# Altium schematic sheet [03] - LoRa MODULE AND CONNECTIONS.SchDoc
size A4; DocumentNumber: 3; SheetNumber: 3; SheetTotal: 6
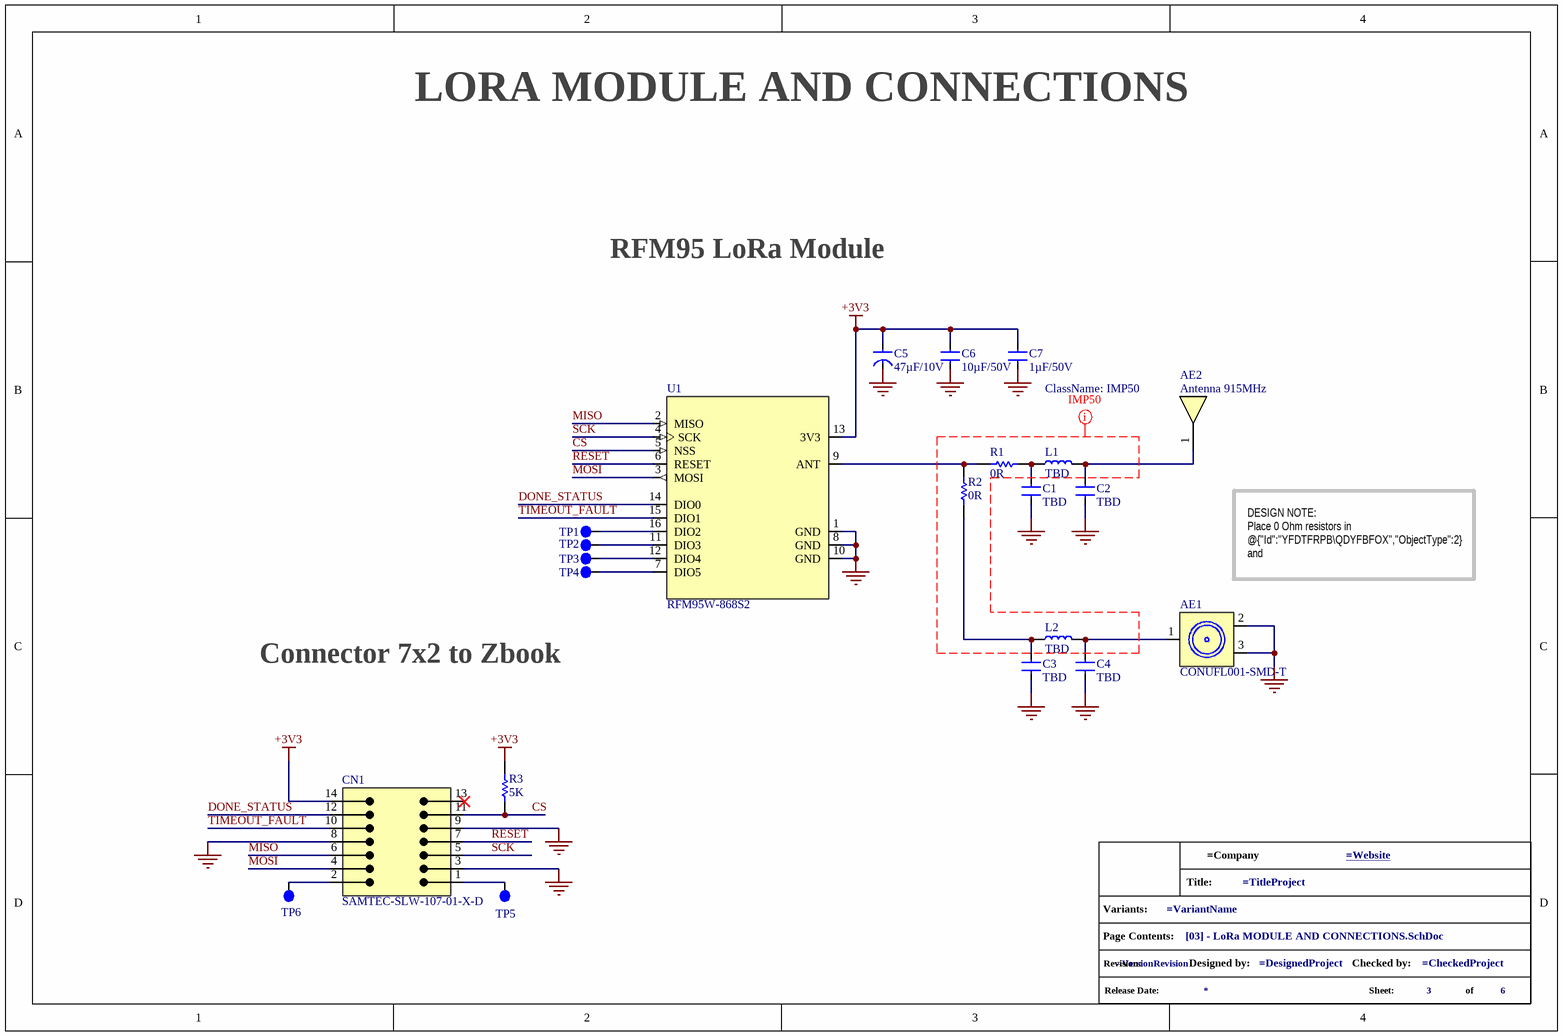
[diagram p0: [03] - LoRa MODULE AND CONNECTIONS.SchDoc]

## Parts
*?  info_project  (value not drawn)  (graphical)
AE1  CONUFL001-SMD-T  [LINX_CONUFL001-SMD-T]
AE2  Antenna 915MHz  [0915AT43A0026]
C1  TBD  [C0603]
C2  TBD  [C0603]
C3  TBD  [C0603]
C4  TBD  [C0603]
C5  47µF/10V  [WCAP-PSLP_5X5.5(DXL)]
C6  10µF/50V  [C0805]
C7  1µF/50V  [C0402]
CN1  SAMTEC-SLW-107-01-X-D  [SAMTEC-SLW-107-01-X-D]
L1  TBD  [L0603]
L2  TBD  [L0603]
R1  0R  [R0603]
R2  0R  [R0603]
R3  5K  [R0402]
TP1  TestPoint  [Test Point]  (value not drawn)  (no BOM)
TP2  TestPoint  [Test Point]  (value not drawn)  (no BOM)
TP3  TestPoint  [Test Point]  (value not drawn)  (no BOM)
TP4  TestPoint  [Test Point]  (value not drawn)  (no BOM)
TP5  TestPoint  [Test Point]  (value not drawn)  (no BOM)
TP6  TestPoint  [Test Point]  (value not drawn)  (no BOM)
U1  RFM95W-868S2  [XCVR_RFM95W-868S2]

## Nets
+3V3: C5.1 C6.2 C7.2 CN1.14 R3.2 U1.13(3V3)
GND: AE1.2 AE1.3 C1.1 C2.1 C3.1 C4.1 C5.2 C6.1 C7.1 CN1.3 CN1.8 CN1.9 U1.1(GND) U1.8(GND) U1.10(GND)
CS: CN1.11 R3.1 U1.5(NSS)
DONE_STATUS: CN1.12 U1.14(DIO0)
MISO: CN1.6 U1.2(MISO)
MOSI: CN1.4 U1.3(MOSI)
RESET: CN1.7 U1.6(RESET)
SCK: CN1.5 U1.4(SCK)
TIMEOUT_FAULT: CN1.10 U1.15(DIO1)
NetAE1_1: AE1.1 C4.2 L2.2
NetAE2_1: AE2.1(Feeding_Point) C2.2 L1.2
NetC1_2: C1.2 L1.1 R1.2
NetC3_2: C3.2 L2.1 R2.1
NetCN1_1: CN1.1 TP5.1
NetCN1_2: CN1.2 TP6.1
NetR1_1: R1.1 R2.2 U1.9(ANT)
NetTP1_1: TP1.1 U1.16(DIO2)
NetTP2_1: TP2.1 U1.11(DIO3)
NetTP3_1: TP3.1 U1.12(DIO4)
NetTP4_1: TP4.1 U1.7(DIO5)

Not connected (* = marked no-connect by the designer): CN1 13*

## Layout directives
net class IMP50: GND

## Notes on the sheet
- LORA MODULE AND CONNECTIONS
- RFM95 LoRa Module
- DESIGN NOTE:
  Place 0 Ohm resistors in @{"Id":"YFDTFRPB\QDYFBFOX","ObjectType":2} and @{"Id":"YFDTFRPB\AJFOYPLD","ObjectType":2} to use the antennas without optimization.
- Connector 7x2 to Zbook
- (in symbol info_project) Title:; Variants:; Page Contents:; Revision:; Designed by:; Checked by:; Release Date:; Sheet:; of

## Library data of the parts
*? = info_project: GRAPHICAL - Info Project
AE1 = CONUFL001-SMD-T: RF CONN - U.FL/MHF1 Jack 50 Ohm PCB Surface Mount; Manufacturer 1: TE Connectivity; .Mounting: SMD; SnapEDA_Link: https://www.snapeda.com/parts/CONUFL001-SMD-T/TE+Connectivity/view-part/?ref=snap; Package: None; Value: *; Manufacturer Part Number 1: CONUFL001-SMD-T; Check_prices: https://www.snapeda.com/parts/CONUFL001-SMD-T/TE+Connectivity/view-part/?ref=eda; .PCBChecked: *; .SCHChecked: *
AE2 = 0915AT43A0026E: RF ANT - 915MHZ  CHIP SOLDER SMD; Manufacturer: Johanson Manufactoring; Resistance: 50R; .SCHChecked: Alex Batista; Supplier 1: Digi-Key; Manufacturer Part Number: 0915AT43A0026E; Stock 1: 21212; Pricing 1: 1=0.84000, 10=0.75200, 25=0.71400, 100=0.58650, 250=0.54824, 500=0.48450 (USD); RoHS: Yes; ComponentLink1URL: http://www.johansontechnology.com/images/stories/ip/rf-antennas/Antenna_0915AT43A0026_v2.pdf?src-supplier=Farnell; ComponentLink1Description: http://www.johansontechnology.com/images/stories/ip/rf-antennas/Antenna_0915AT43A0026_v2.pdf?src-supplier=Farnell; ComponentLink2URL: http://www.farnell.com/datasheets/1928701.pdf?src-supplier=Newark; ComponentLink2Description: http://www.farnell.com/datasheets/1928701.pdf?src-supplier=Newark; ComponentLink3URL: http://www.farnell.com/datasheets/1318299.pdf?src-supplier=Newark; ComponentLink3Description: http://www.farnell.com/datasheets/1318299.pdf?src-supplier=Newark; Supplier Part Number 1: 712-1535-1-ND; .PCBChecked: Alex Batista
C1-C4 = MLCC_0603: MLCC - TBD 0603
C5 = WCAP-PSLP_5X5.5: CAP - 47UF 20% 10V; Manufacturer 1: Würth Elektronik; Manufacturer Part Number 1: 875105242006; .Mounting: SMD; Package: None; Price: None; Value: *; Availability: Unavailable; .PCBChecked: *; .SCHChecked: *
C6 = GRM21BR61H106KE43L: MLCC - 10µF 50V X5R 0805 ±10%; Manufacturer 1: Murata; Manufacturer Lifecycle Status: IN PRODUCTION; Dielectric Material: Ceramic; .Mounting: SMT; Supplier: Avnet; Supplier Part Number: GRM21BR61H106KE43L; Manufacturer Part Number 1: GRM21BR61H106KE43L; RoHS: Compliant; Category: Ceramic Capacitors; Stock: 525000; Pricing: 3000=0,05122, 6000=0,0502, 12000=0,04948, 24000=0,04878, 48000=0,04738 (USD); Value: 10µF; Case/Package: 0805; Country of Origin: Japan, Mainland China, Philippines, Singapore, Thailand; Dielectric: X5R; Export Control Classification Number (ECCN) Code: EAR99; Height: 1.25mm; Harmonized Tariff Schedule (HTS) Code: 8532.24.00.20; Introduction Date: 2018-09-13; Length: 2mm; Lifecycle Status: Production; Material: Ceramic; Max Operating Temperature: 85°C; Min Operating Temperature: -55°C; Mounting Technology: Surface Mount; Number of Terminals: 2; REACH SVHC: Yes; Thickness: 1.25mm; Tolerance: 10%; Voltage Rating: 50V; Voltage Rating (DC): 50V; Width: 1.25mm; ComponentLink1URL: https://datasheet.octopart.com:443/GRM21BR61H106KE43L-Murata-datasheet-155345082.pdf?src-supplier=Newark; ComponentLink1Description: https://datasheet.octopart.com:443/GRM21BR61H106KE43L-Murata-datasheet-155345082.pdf?src-supplier=Newark; ComponentLink2URL: https://datasheet.octopart.com:443/GRM21BR61H106KE43L-Murata-datasheet-141278272.pdf?src-supplier=Geoflip; ComponentLink2Description: https://datasheet.octopart.com:443/GRM21BR61H106KE43L-Murata-datasheet-141278272.pdf?src-supplier=Geoflip; ComponentLink3URL: https://datasheet.octopart.com:443/GRM21BR61H106KE43L-Murata-datasheet-165579666.pdf?src-supplier=TME; ComponentLink3Description: https://datasheet.octopart.com:443/GRM21BR61H106KE43L-Murata-datasheet-165579666.pdf?src-supplier=TME; ComponentLink4URL: https://datasheet.octopart.com:443/GRM21BR61H106KE43L-Murata-datasheet-140707579.pdf?src-supplier=Ciiva; ComponentLink4Description: https://datasheet.octopart.com:443/GRM21BR61H106KE43L-Murata-datasheet-140707579.pdf?src-supplier=Ciiva; ComponentLink5URL: https://datasheet.octopart.com:443/GRM21BR61H106KE43L-Murata-datasheet-138744880.pdf?src-supplier=Ciiva; ComponentLink5Description: https://datasheet.octopart.com:443/GRM21BR61H106KE43L-Murata-datasheet-138744880.pdf?src-supplier=Ciiva; ComponentLink6URL: https://datasheet.octopart.com/GRM21BR61H106KE43L-Murata-datasheet-12515295.pdf; ComponentLink6Description: https://datasheet.octopart.com/GRM21BR61H106KE43L-Murata-datasheet-12515295.pdf; ComponentLink7URL: https://datasheet.octopart.com/GRM21BR61H106KE43L-Murata-datasheet-12510076.pdf; ComponentLink7Description: https://datasheet.octopart.com/GRM21BR61H106KE43L-Murata-datasheet-12510076.pdf; ComponentLink8URL: https://datasheet.octopart.com/GRM21BR61H106KE43L-Murata-datasheet-11978611.pdf; ComponentLink8Description: https://datasheet.octopart.com/GRM21BR61H106KE43L-Murata-datasheet-11978611.pdf; ComponentLink9URL: https://datasheet.octopart.com/GRM21BR61H106KE43L-Murata-datasheet-10025737.pdf; ComponentLink9Description: https://datasheet.octopart.com/GRM21BR61H106KE43L-Murata-datasheet-10025737.pdf; ComponentLink10URL: https://datasheet.octopart.com/GRM21BR61H106KE43L-Murata-datasheet-8819587.pdf; ComponentLink10Description: https://datasheet.octopart.com/GRM21BR61H106KE43L-Murata-datasheet-8819587.pdf; ComponentLink11URL: http://sigma.octopart.com:80/reach_statement/Murata-company-16.pdf?src-supplier=Compliance+Statements; ComponentLink11Description: http://sigma.octopart.com:80/reach_statement/Murata-company-16.pdf?src-supplier=Compliance+Statements; .SCHChecked: *; .PCBChecked: *
C7 = MSASU105CB5105KFNA01: MLCC - 1µF 50V X5R 0402 ±10%; Manufacturer 1: Taiyo Yuden; .Mounting: SMT; .SCHChecked: Lucas Vieira; Supplier: Digikey; Supplier Part Number: 587-MSASU105CB5105KFNA01CT-ND; Manufacturer Part Number 1: MSASU105CB5105KFNA01; RoHS: Yes; Category: Ceramic Capacitors; Stock: 15208; Pricing: 1=0,28, 10=0,184, 50=0,1288, 100=0,1041, 500=0,07732, 1000=0,06766, 2500=0,06444, 5000=0,05961 (USD); Reach SVHC Compliant: Yes; RoHS Compliant: Yes; .PCBChecked: Lucas Vieira; Manufacturer 2: Murata Electronics; Manufacturer Part Number 2: GRM155R61H105KE05D; Manufacturer 3: Murata Electronics; Manufacturer Part Number 3: GRM155R61E105KA12D; Supplier 1: Digikey; Supplier Part Number 1: 587-MSASU105CB5105KFNA01CT-ND
CN1 = SAMTEC-SLW-107-01-X-D: HEADER - 14 Position Receptacle Connector 0.100" (2.54mm) Through Hole Gold; Manufacturer 1: Samtec Inc.; .Mounting: PTH; Package: None; Price: None; Value: *; Manufacturer Part Number 1: SAMTEC-SLW-107-01-X-D; Availability: Unavailable; .PCBChecked: *; .SCHChecked: *
L1 L2 = Inductor_0603: INDUCTOR - TBD 0603
R1 R2 = RC0603FR-070RL: RES - 0R 1/10W 0603; Manufacturer 1: Yageo Group; Current Rating: 1A; Max Power Dissipation: 100mW; Value: 0Ω; Temperature Coefficient: 200ppm/°C; Tolerance: 1%; Voltage Rating: 75V; Voltage Rating (DC): 50V; .Mounting: SMD; Supplier: Avnet; Supplier Part Number: RC0603FR-070RL; Manufacturer Part Number 1: RC0603FR-070RL; RoHS: Compliant; Category: Chip SMD Resistors; Stock: 190618; Pricing: 1=0,101, 25=0,009, 100=0,008, 250=0,007, 500=0,006, 1000=0,005, 2500=0,004 (USD); Case/Package: 0603; Case Code (Imperial): 0603; China RoHS: Non-Compliant; Composition: Thick Film; Contact Plating: Tin; Depth: 800µm; Features: Moisture Resistant; Height: 450µm; Lead Free: Lead Free; Length: 1.6mm; Lifecycle Status: Production; Max Operating Temperature: 155°C; Military Standard: Not; Min Operating Temperature: -55°C; Mounting Technology: Surface Mount; Pins: 2; Number of Terminals: 2; Number of Terminations: 2; Packaging: Tape & Reel; Power Rating: 100mW; Radiation Hardening: No; REACH SVHC: Unaffected; Schedule B: 8533210045, 8533210045|8533210045|8533210045|8533210045|8533210045; Termination: SMD/SMT; Width: 800µm; Working Voltage: 75V; ComponentLink1URL: https://datasheet.octopart.com:443/RC0603FR-070RL-Yageo-datasheet-127823281.pdf?src-supplier=Upverter; ComponentLink1Description: https://datasheet.octopart.com:443/RC0603FR-070RL-Yageo-datasheet-127823281.pdf?src-supplier=Upverter; ComponentLink2URL: https://datasheet.octopart.com:443/RC0603FR-070RL-Yageo-datasheet-30459151.pdf?src-supplier=IHS; ComponentLink2Description: https://datasheet.octopart.com:443/RC0603FR-070RL-Yageo-datasheet-30459151.pdf?src-supplier=IHS; ComponentLink3URL: https://datasheet.octopart.com:443/RC0603FR-070RL-Yageo-datasheet-8328172.pdf?src-supplier=element14+APAC; ComponentLink3Description: https://datasheet.octopart.com:443/RC0603FR-070RL-Yageo-datasheet-8328172.pdf?src-supplier=element14+APAC; ComponentLink4URL: https://datasheet.octopart.com:443/RC0603FR-070RL-Yageo-datasheet-34211833.pdf?src-supplier=Newark; ComponentLink4Description: https://datasheet.octopart.com:443/RC0603FR-070RL-Yageo-datasheet-34211833.pdf?src-supplier=Newark; ComponentLink5URL: https://datasheet.octopart.com:443/RC0603FR-070RL-Yageo-Group-datasheet-176638170.pdf?src-supplier=Future+Electronics; ComponentLink5Description: https://datasheet.octopart.com:443/RC0603FR-070RL-Yageo-Group-datasheet-176638170.pdf?src-supplier=Future+Electronics; ComponentLink6URL: https://datasheet.octopart.com:443/RC0603FR-070RL-Yageo-datasheet-164759695.pdf?src-supplier=Future+Electronics; ComponentLink6Description: https://datasheet.octopart.com:443/RC0603FR-070RL-Yageo-datasheet-164759695.pdf?src-supplier=Future+Electronics; ComponentLink7URL: https://datasheet.octopart.com:443/RC0603FR-070RL-Yageo-datasheet-137700087.pdf?src-supplier=Future+Electronics; ComponentLink7Description: https://datasheet.octopart.com:443/RC0603FR-070RL-Yageo-datasheet-137700087.pdf?src-supplier=Future+Electronics; ComponentLink8URL: https://datasheet.octopart.com:443/RC0603FR-070RL-Yageo-datasheet-15599030.pdf?src-supplier=Future+Electronics; ComponentLink8Description: https://datasheet.octopart.com:443/RC0603FR-070RL-Yageo-datasheet-15599030.pdf?src-supplier=Future+Electronics; ComponentLink9URL: https://datasheet.octopart.com:443/RC0603FR-070RL-Yageo-datasheet-12596169.pdf?src-supplier=Future+Electronics; ComponentLink9Description: https://datasheet.octopart.com:443/RC0603FR-070RL-Yageo-datasheet-12596169.pdf?src-supplier=Future+Electronics; ComponentLink10URL: https://datasheet.octopart.com/RC0603FR-070RL-Yageo-datasheet-73766026.pdf; ComponentLink10Description: https://datasheet.octopart.com/RC0603FR-070RL-Yageo-datasheet-73766026.pdf; ComponentLink11URL: http://sigma.octopart.com:80/conflict_mineral_statement/Yageo-company-3.pdf?src-supplier=Compliance+Statements; ComponentLink11Description: http://sigma.octopart.com:80/conflict_mineral_statement/Yageo-company-3.pdf?src-supplier=Compliance+Statements; ComponentLink12URL: http://sigma.octopart.com:80/rohs_statement/Yageo-company-2.pdf?src-supplier=Compliance+Statements; ComponentLink12Description: http://sigma.octopart.com:80/rohs_statement/Yageo-company-2.pdf?src-supplier=Compliance+Statements; .PCBChecked: *; .SCHChecked: *
R3 = RC0402FR-075KL: RES - 5K 1/16W 0402 ±1%; Manufacturer 1: Yageo Group; Max Power Dissipation: 63mW; Power Rating: 62.5mW; Value: 5kΩ; Temperature Coefficient: 100ppm/°C; Voltage Rating: 50V; .Mounting: SMD; Supplier: Newark; Supplier Part Number: RC0402FR-075KL; Manufacturer Part Number 1: RC0402FR-075KL; RoHS: Compliant; Category: Chip SMD Resistors; Stock: 9852; Pricing: 1=0,101, 25=0,012, 100=0,009, 250=0,008, 500=0,007, 1000=0,006, 2500=0,005, 5000=0,004 (USD); Case/Package: 0402; China RoHS: Non-Compliant; Composition: Thick Film; Country of Origin: Mainland China, Taiwan; Export Control Classification Number (ECCN) Code: EAR99; Features: Moisture Resistant; Height: 350µm; Harmonized Tariff Schedule (HTS) Code: 8533.21.00.30; Introduction Date: 2011-11-17; Length: 1mm; Lifecycle Status: Production; Max Operating Temperature: 155°C; Min Operating Temperature: -55°C; Mounting Technology: Surface Mount; Number of Terminals: 2; Number of Terminations: 2; REACH SVHC: Yes; Schedule B: 8533210045, 8533210045|8533210045|8533210045|8533210045|8533210045; Tolerance: 1%; Width: 500µm; Working Voltage: 50V; ComponentLink1URL: https://datasheet.octopart.com:443/RC0402FR-075KL-Yageo-datasheet-127823281.pdf?src-supplier=Upverter; ComponentLink1Description: https://datasheet.octopart.com:443/RC0402FR-075KL-Yageo-datasheet-127823281.pdf?src-supplier=Upverter; ComponentLink2URL: https://datasheet.octopart.com:443/RC0402FR-075KL-Yageo-datasheet-137700087.pdf?src-supplier=IHS; ComponentLink2Description: https://datasheet.octopart.com:443/RC0402FR-075KL-Yageo-datasheet-137700087.pdf?src-supplier=IHS; ComponentLink3URL: https://datasheet.octopart.com:443/RC0402FR-075KL-Yageo-Group-datasheet-176638170.pdf?src-supplier=Future+Electronics; ComponentLink3Description: https://datasheet.octopart.com:443/RC0402FR-075KL-Yageo-Group-datasheet-176638170.pdf?src-supplier=Future+Electronics; ComponentLink4URL: https://datasheet.octopart.com:443/RC0402FR-075KL-Yageo-datasheet-164759695.pdf?src-supplier=Future+Electronics; ComponentLink4Description: https://datasheet.octopart.com:443/RC0402FR-075KL-Yageo-datasheet-164759695.pdf?src-supplier=Future+Electronics; ComponentLink5URL: https://datasheet.octopart.com:443/RC0402FR-075KL-Yageo-datasheet-175887523.pdf?src-supplier=Newark; ComponentLink5Description: https://datasheet.octopart.com:443/RC0402FR-075KL-Yageo-datasheet-175887523.pdf?src-supplier=Newark; ComponentLink6URL: https://datasheet.octopart.com/RC0402FR-075KL-Yageo-datasheet-73766026.pdf; ComponentLink6Description: https://datasheet.octopart.com/RC0402FR-075KL-Yageo-datasheet-73766026.pdf; ComponentLink7URL: http://sigma.octopart.com:80/conflict_mineral_statement/Yageo-company-3.pdf?src-supplier=Compliance+Statements; ComponentLink7Description: http://sigma.octopart.com:80/conflict_mineral_statement/Yageo-company-3.pdf?src-supplier=Compliance+Statements; ComponentLink8URL: http://sigma.octopart.com:80/rohs_statement/Yageo-company-2.pdf?src-supplier=Compliance+Statements; ComponentLink8Description: http://sigma.octopart.com:80/rohs_statement/Yageo-company-2.pdf?src-supplier=Compliance+Statements; .SCHChecked: *; .PCBChecked: *
TP1-TP6 = Test_Point: MECH - Test Points
U1 = RFM95W-868S2: MODULE - General ISM < 1GHz LoRaâ„¢ Transceiver Module 868MHz Antenna Not Included Surface Mount; Manufacturer 1: RF; .Mounting: SMD; Package: Non Standard RF Solutions; Price: None; Check_prices: https://www.snapeda.com/parts/RFM95W-868S2/RF+Solutions/view-part/?ref=eda; Value: *; SnapEDA_Link: https://www.snapeda.com/parts/RFM95W-868S2/RF+Solutions/view-part/?ref=snap; Manufacturer Part Number 1: RFM95W-868S2; Availability: In Stock; Purchase-URL: https://pricing.snapeda.com/search?q=RFM95W-868S2&ref=eda; .PCBChecked: *; .SCHChecked: *